# Altium schematic sheet Net Names 1.SchDoc
size A4; SheetNumber: 1; SheetTotal: 3
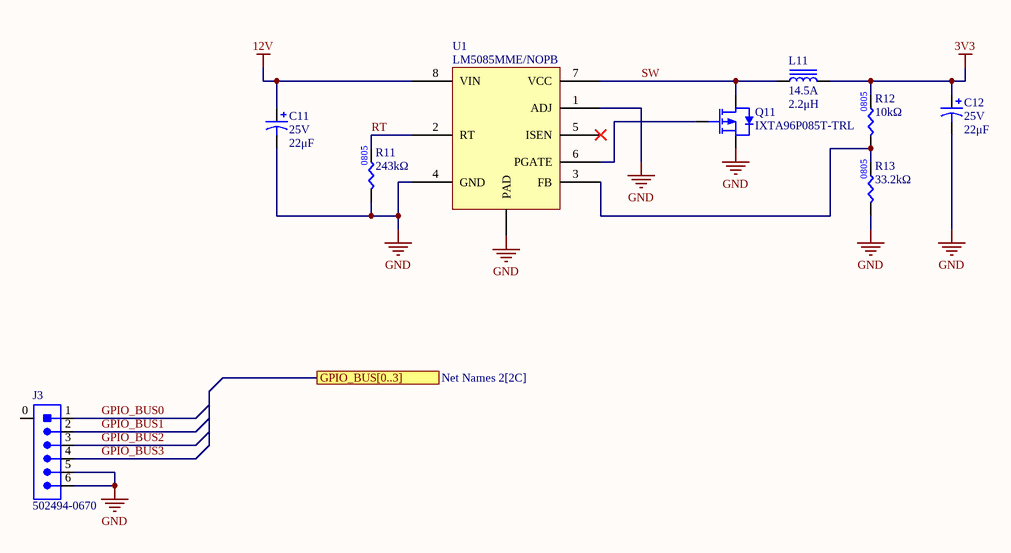
[diagram p0: Net Names 1.SchDoc]

## Parts
C11  value 22μF  Voltage Rating: 25V  [CAP2917]  (hidden comment: CAP_22uF_25V_TANT)
C12  value 22μF  Voltage Rating: 25V  [CAP2917]  (hidden comment: CAP_22uF_25V_TANT)
J3  Manufacturer Part Number 1: 502494-0670  [MOLEX-5024940670]  (hidden comment: CON_6M_SM_RA)
L11  Current Rating: 14.5A  Inductance: 2.2μH  [IND_VISHAY_IHLP3232DZER2R2M11]  (hidden comment: IND_2.2uH_14.5A)
Q11  Manufacturer Part Number 1: IXTA96P085T-TRL  [D-PAK]  (hidden comment: PMOS_85V_96A)
R11  value 243kΩ  [RES0805]  (hidden comment: RES_243kΩ_0805_1%)
R12  value 10kΩ  [RES0805]  (hidden comment: RES_10kΩ_0805_5%)
R13  value 33.2kΩ  [RES0805]  (hidden comment: RES_33.2kΩ_0805_1%)
U1  Manufacturer Part Number 1: LM5085MME/NOPB  [8-VSSOP]  (hidden comment: BUCK_LMR14050SDDAR)

## Ports
GPIO_BUS[0..3] (see Net Names 2[2C])

## Nets
3V3: C12.1 L11.2 R12.2
12V: C11.1 U1.8(VIN)
GND: C11.2 C12.2 J3.5 J3.6 Q11.3(Source) R11.1 R13.1 U1.1(ADJ) U1.4(GND) U1.9(PAD)
GPIO_BUS0: J3.1
GPIO_BUS1: J3.2
GPIO_BUS2: J3.3
GPIO_BUS3: J3.4
RT: R11.2 U1.2(RT)
SW: L11.1 Q11.1(Drain) U1.7(VCC)
NetQ11_2: Q11.2(Gate) U1.6(PGATE)
NetR12_1: R12.1 R13.2 U1.3(FB)

Not connected (* = marked no-connect by the designer): J3 0; U1 5(ISEN)*

## Library data of the parts
C11 C12 = CAP_22uF_25V_TANT: CAP TANT 22UF 20% 25V 2917; Manufacturer Part Number 1: F971A106MBAHT3; Manufacturer 1: AVX Corporation; Supplier 1: Arrow Electronics; Supplier Part Number 1: TPSD226M025R0100
J3 = CON_6M_SM_RA: CONN HEADER SMD RIGHT ANGLE 2MM PITCH; Manufacturer 1: Molex; Current Rating: 3A; Voltage Rating: 250V; Supplier 1: Digi-Key; Orientation: Right Angle; Pitch: 2mm; Supplier Part Number 1: WM2283CT-ND
L11 = IND_2.2uH_14.5A: INDUCTOR 2.2UH 14.5A 9.41 MOHM; Manufacturer 1: Vishay Dale; Manufacturer Part Number 1: IHLP3232DZER2R2M11; Inductance Tolerance: 20%; Saturation Current: 10.2A; Supplier Part Number 1: 541-1350-1-ND; Supplier 1: Digi-Key; DC Resistance (DCR): 9.41mOhm; Mounting Type: SMD
Q11 = PMOS_85V_96A: MOSFET P-CH 85V 96A TO263; Manufacturer 1: IXYS; Package/Footprint: TO-263AA; Vgs (Max): ±15V; Mounting Type: SMD; Verified: No; Supplier 1: Digi-Key; Supplier Part Number 1: IXTA96P085T-TRLCT-ND; Id: 96A; Vdss: 85V
R11 = RES_243kΩ_0805_1%: RES 243K OHM 1% 1/8W 0805; Manufacturer 1: Stackpole Electronics Inc; Manufacturer Part Number 1: RMCF0805FT243K; Package/Footprint: 0805; Mounting Type: SMD; Supplier 1: Digi-Key; Supplier Part Number 1: RMCF0805FT243KCT-ND
R12 = RES_10kΩ_0805_5%: RES 10K OHM 5% 1/8W 0805; Manufacturer 1: Panasonic Electronic Components; Manufacturer Part Number 1: ERJ-6GEYJ103V; Package/Footprint: 0805; Supplier 1: Digi-Key; Supplier Part Number 1: P10KACT-ND; LCSC Part #: C17414; Mounting Type: SMD
R13 = RES_33.2kΩ_0805_1%: RES 33.2K OHM 1% 1/8W 0805; Manufacturer 1: Stackpole Electronics Inc; Manufacturer Part Number 1: RMCF0805FT33K2; Package/Footprint: 0805; Mounting Type: SMD; Supplier 1: Digi-Key; Supplier Part Number 1: RMCF0805FT33K2CT-ND
U1 = BUCK_LM5085: IC REG CTRLR BUCK 8VSSOP; Manufacturer 1: Texas Instruments; Output Type: Transistor Driver; Output Configuration: Positive; Package/Footprint: 8-VSSON; Mounting Type: SMD; Supplier 1: Digi-Key; Supplier Part Number 1: LM5085MME/NOPBCT-ND